# EAGLE design Controladora 60 amp directa (EAGLE 9.5.1)
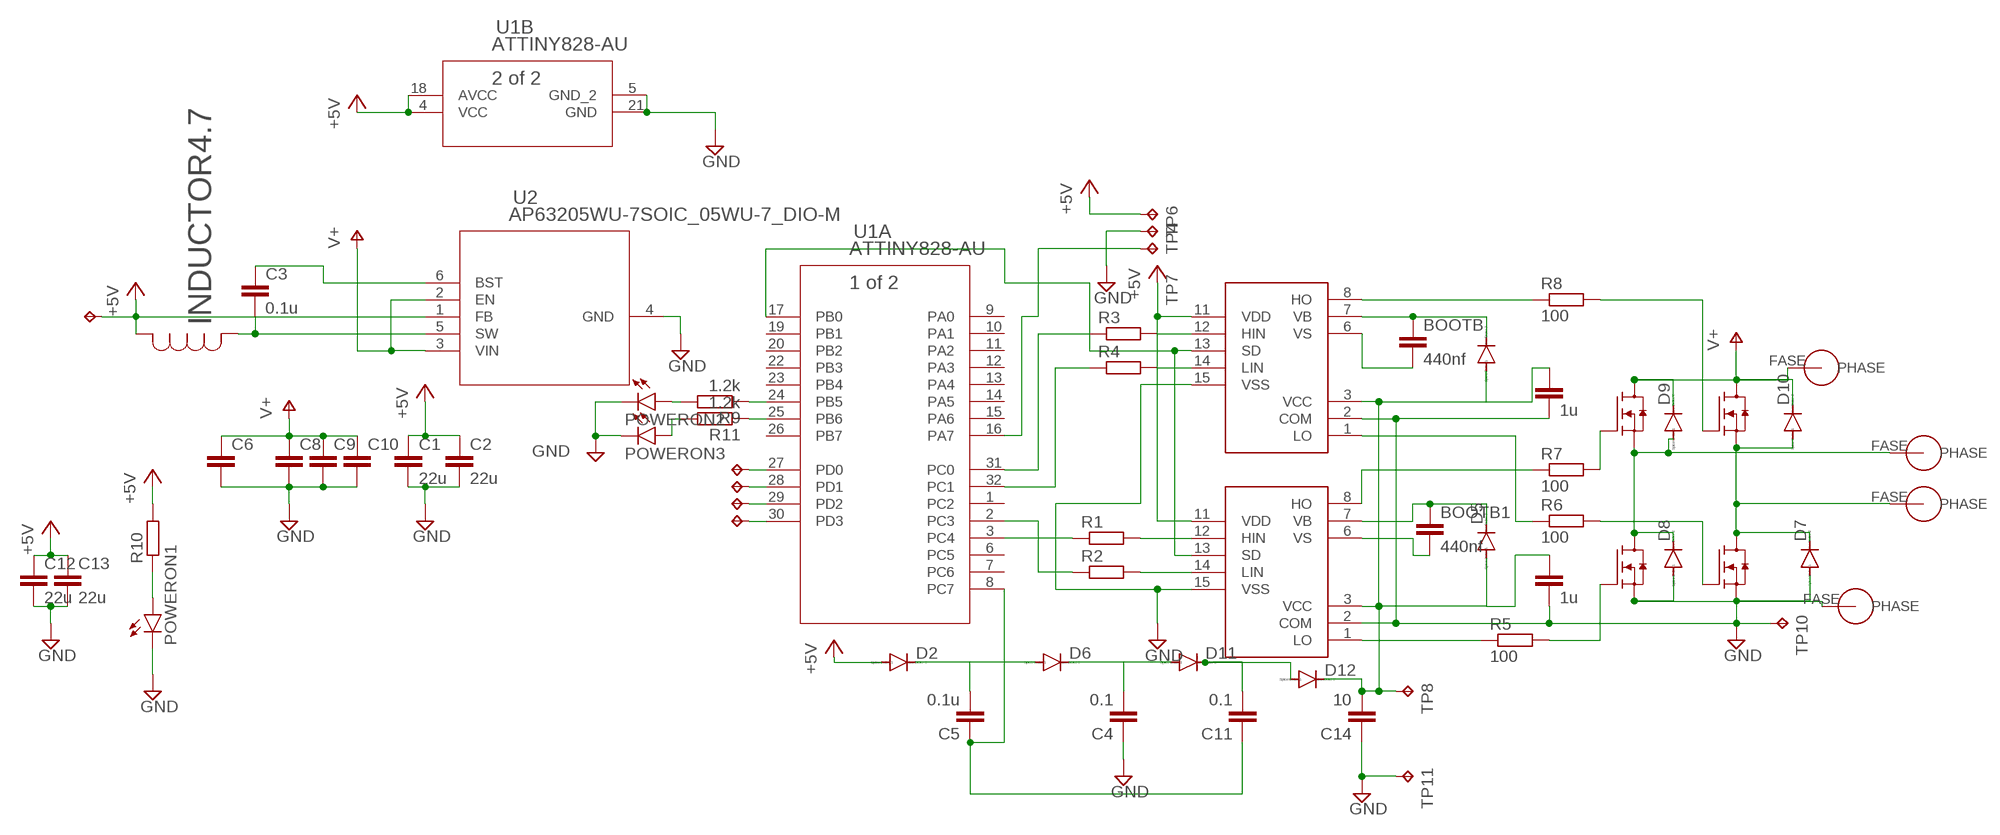
[diagram p0: schematic, sheet 1]

## Parts
BOOTB  440nf  C-EUC0805  [C0805]
BOOTB1  440nf  C-EUC0805  [C0805]
BYPASSBOOT  1u  C-EUC0805  [C0805]
BYPASSBOOT2  1u  C-EUC0805  [C0805]
C1  22u  C-EUC0805  [C0805]
C2  22u  C-EUC0805  [C0805]
C3  0.1u  C-EUC0402  [C0402]
C4  0.1  C-EUC0805  [C0805]
C5  0.1u  C-EUC0805  [C0805]
C6  C-EUC0805  [C0805]
C8  C-EUC0805  [C0805]
C9  C-EU050-035X075  [C050-035X075]
C10  C-EU050-035X075  [C050-035X075]
C11  0.1  C-EUC0805  [C0805]
C12  22u  C-EUC0402  [C0402]
C13  22u  C-EUC0402  [C0402]
C14  10  C-EUC0805  [C0805]
D1  IRS2110SPBF  [SOIC127P1030X265-16N]
D2  DIODE-MINIMELF  [MINIMELF]
D3  IRS2110SPBF  [SOIC127P1030X265-16N]
D4  DIODE-MINIMELF  [MINIMELF]
D5  DIODE-MINIMELF  [MINIMELF]
D6  DIODE-MINIMELF  [MINIMELF]
D7  DIODE-MINIMELF  [MINIMELF]
D8  DIODE-MINIMELF  [MINIMELF]
D9  DIODE-MINIMELF  [MINIMELF]
D10  DIODE-MINIMELF  [MINIMELF]
D11  DIODE-MINIMELF  [MINIMELF]
D12  DIODE-MINIMELF  [MINIMELF]
FASEA  PHASE  [POWEROUT]
FASEA1  PHASE  [POWEROUT]
FASEA2  PHASE  [POWEROUT]
FASEA3  PHASE  [POWEROUT]
LA  IPB180N06S4-H1  [PG-TO263-7-3]
LA1  IPB180N06S4-H1  [PG-TO263-7-3]
LA2  IPB180N06S4-H1  [PG-TO263-7-3]
LA3  IPB180N06S4-H1  [PG-TO263-7-3]
POWERON1  LEDCHIPLED_0603  [CHIPLED_0603]
POWERON2  LEDCHIPLED_0603  [CHIPLED_0603]
POWERON3  LEDCHIPLED_0603  [CHIPLED_0603]
R1  R-EU_M0805  [M0805]
R2  R-EU_M0805  [M0805]
R3  R-EU_M0805  [M0805]
R4  R-EU_M0805  [M0805]
R5  100  R-EU_M0805  [M0805]
R6  100  R-EU_M0805  [M0805]
R7  100  R-EU_M0805  [M0805]
R8  100  R-EU_M0805  [M0805]
R9  1.2k  R-EU_M0805  [M0805]
R10  R-EU_M0805  [M0805]
R11  1.2k  R-EU_M0805  [M0805]
TP1  TPTP16SQ  [TP16SQ]
TP2  TPTP16SQ  [TP16SQ]
TP3  TPTP16SQ  [TP16SQ]
TP4  TPTP16SQ  [TP16SQ]
TP5  TPTP16SQ  [TP16SQ]
TP6  TPTP16SQ  [TP16SQ]
TP7  TPTP16SQ  [TP16SQ]
TP8  TPB1,27  [B1,27]
TP9  TPB1,27  [B1,27]
TP10  TPB1,27  [B1,27]
TP11  TPB1,27  [B1,27]
U1  ATTINY828-AU  [32A_ATM]
U2  AP63205WU-7SOIC_05WU-7_DIO-M  [SOIC_05WU-7_DIO-M]
U$1  INDUCTOR4.7  [IND_NRS5030T100MMGJ_TAY]

## Nets
+5V: C1.1 C2.1 C12.1 C13.1 D1.11(VDD) D2.A D3.11(VDD) R10.2 TP6.TP TP9.TP U1.4(B:VCC) U1.18(B:AVCC) U2.1(FB) U$1.1
GND: BYPASSBOOT2.2 BYPASSBOOT.2 C1.2 C2.2 C4.1 C6.2 C8.2 C9.2 C10.2 C12.2 C13.2 C14.1 D1.2(COM) D1.15(VSS) D3.2(COM) D3.15(VSS) D7.A D8.A FASEA3.FASE(PHASE) LA1.2(S) LA1.3(S) LA1.5(S) LA1.6(S) LA1.7(S) LA3.2(S) LA3.3(S) LA3.5(S) LA3.6(S) LA3.7(S) POWERON1.C POWERON2.C POWERON3.C TP4.TP TP10.TP TP11.TP U1.5(B:GND_2) U1.21(B:GND) U2.4(GND)
N$1: TP3.TP U1.30(A:PD3)
N$2: TP2.TP U1.29(A:PD2)
N$3: TP1.TP U1.28(A:PD1)
N$4: TP5.TP U1.27(A:PD0)
N$5: R1.1 U1.3(A:PC4)
N$6: R2.1 U1.2(A:PC3)
N$7: BYPASSBOOT2.1 BYPASSBOOT.1 C14.2 D1.3(VCC) D3.3(VCC) D4.A D5.A D12.C TP8.TP
N$8: C5.2 D2.C D6.A
N$9: D1.12(HIN) R1.2
N$10: D1.14(LIN) R2.2
N$11: R3.1 U1.31(A:PC0)
N$12: D3.12(HIN) R3.2
N$13: R4.1 U1.32(A:PC1)
N$14: D3.14(LIN) R4.2
N$15: C3.2 U2.5(SW) U$1.2
N$16: TP7.TP U1.16(A:PA7)
N$17: D1.13(SD) D3.13(SD) U1.17(A:PB0)
N$18: D8.C D9.A FASEA.FASE(PHASE) LA1.8(D) LA.2(S) LA.3(S) LA.5(S) LA.6(S) LA.7(S)
N$19: D7.C D10.A FASEA1.FASE(PHASE) LA2.2(S) LA2.3(S) LA2.5(S) LA2.6(S) LA2.7(S) LA3.8(D)
N$20: C5.1 C11.1 U1.8(A:PC7)
N$21: D1.1(LO) R5.1
N$22: C3.1 U2.6(BST)
N$23: LA3.1(G) R6.2
N$24: D3.1(LO) R6.1
N$25: LA1.1(G) R5.2
N$26: D1.8(HO) R7.1
N$27: LA2.1(G) R8.2
N$28: D3.8(HO) R8.1
N$29: LA.1(G) R7.2
N$30: BOOTB1.1 D1.7(VB) D5.C
N$31: BOOTB1.2 D1.6(VS)
N$32: BOOTB.1 D3.7(VB) D4.C
N$33: BOOTB.2 D3.6(VS)
N$34: R9.1 U1.24(A:PB5)
N$35: POWERON1.A R10.1
N$36: POWERON2.A R9.2
N$37: R11.1 U1.25(A:PB6)
N$38: POWERON3.A R11.2
N$39: C4.2 D6.C D11.A
N$40: C11.2 D11.C D12.A
V+: C6.1 C8.1 C9.1 C10.1 D9.C D10.C FASEA2.FASE(PHASE) LA2.8(D) LA.8(D) U2.2(EN) U2.3(VIN)
Unconnected: U1.1(A:PC2) U1.6(A:PC5) U1.7(A:PC6) U1.9(A:PA0) U1.10(A:PA1) U1.11(A:PA2) U1.12(A:PA3) U1.13(A:PA4) U1.14(A:PA5) U1.15(A:PA6) U1.19(A:PB1) U1.20(A:PB2) U1.22(A:PB3) U1.23(A:PB4) U1.26(A:PB7)

## Library data of the parts
BOOTB BOOTB1 BYPASSBOOT BYPASSBOOT2 = resistor:C-EU: CAPACITOR, European symbol
C1-C6 C8-C14 = rcl:C-EU: CAPACITOR, European symbol; SPICEPREFIX: C
D1 D3 = SOIC127P1030X265-16N:IRS2110SPBF: IRS2110SPBF MOSFET DRIVER 500-600 V IOUT 2 AMP 130 NS ON 120 NS OFF
D2 D4-D12 = diode:DIODE-: DIODE
FASEA FASEA1-FASEA3 = PHASE:PHASE
LA LA1-LA3 = infineon:IPB180N06S4-H1: OptiMOS®-T2 Power-Transistor Source: 1859075.pdf (Farnell)
POWERON1-POWERON3 = led:LED: LED OSRAM: - CHIPLED LG R971, LG N971, LY N971, LG Q971, LY Q971, LO R971, LY R971 LH N974, LH R974 LS Q976, LO Q976, LY Q976 LO Q996 - Hyper CHIPLED LW Q18S LB Q993, LB Q99A, LB R99A - SideLED LS A670, LO A670, LY A670, LG A670, LP A670 LB A673, LV A673, LT A673, LW A673 LH A674 LY A675 LS A676, LA A676, LO A676, LY A676, LW A676 LS A679, LY A679, LG A679 - Hyper Micro SIDELED® LS Y876, LA Y876, LO Y876, LY Y876 LT Y87S - SmartLED LW L88C, LW L88S LB L89C, LB L89S, LG L890 LS L89K, LO L89K, LY L89K LS L896, LA L896, LO L896, LY L896 - TOPLED LS T670, LO T670, LY T670, LG T670, LP T670 LSG T670, LSP T670, LSY T670, LOP T670, LYG T670 LG T671, LOG T671, LSG T671 LB T673, LV T673, LT T673, LW T673 LH T674 LS T676, LA T676, LO T676, LY T676, LB T676, LH T676, LSB T676, LW T676 LB T67C, LV T67C, LT T67C, LS T67K, LO T67K, LY T67K, LW E67C LS E67B, LA E67B, LO E67B, LY E67B, LB E67C, LV E67C, LT E67C LW T67C LS T679, LY T679, LG T679 LS T770, LO T770, LY T770, LG T770, LP T770 LB T773, LV T773, LT T773, LW T773 LH T774 LS E675, LA E675, LY E675, LS T675 LS T776, LA T776, LO T776, LY T776, LB T776 LHGB T686 LT T68C, LB T68C - Hyper Mini TOPLED® LB M676 - Mini TOPLED Santana® LG M470 LS M47K, LO M47K, LY M47K Source: http://www.osram.convergy.de LUXEON: - LUMILED® LXK2-PW12-R00, LXK2-PW12-S00, LXK2-PW14-U00, LXK2-PW14-V00 LXK2-PM12-R00, LXK2-PM12-S00, LXK2-PM14-U00 LXK2-PE12-Q00, LXK2-PE12-R00, LXK2-PE12-S00, LXK2-PE14-T00, LXK2-PE14-U00 LXK2-PB12-K00, LXK2-PB12-L00, LXK2-PB12-M00, LXK2-PB14-N00, LXK2-PB14-P00, LXK2-PB14-Q00 LXK2-PR12-L00, LXK2-PR12-M00, LXK2-PR14-Q00, LXK2-PR14-R00 LXK2-PD12-Q00, LXK2-PD12-R00, LXK2-PD12-S00 LXK2-PH12-R00, LXK2-PH12-S00 LXK2-PL12-P00, LXK2-PL12-Q00, LXK2-PL12-R00 Source: www.luxeon.com KINGBRIGHT: KA-3528ASYC Source: www.kingbright.com
R1-R11 = rcl:R-EU_: RESISTOR, European symbol; SPICEPREFIX: R
TP1-TP11 = testpad:TP: Test pad
U1 = nuevoattiny828:ATTINY828-AU; BUILT_BY: EMA_UL_Team; MANUFACTURER_PART_NUMBER: ATTINY828-AU; SOURCELIBRARY: Atmel_2015-02-13; VENDOR: Atmel
U2 = AP63205WU-7:AP63205WU-7; BUILT_BY: EMA_Matt; COPYRIGHT: Copyright (C) 2018 Accelerated Designs. All rights reserved; MANUFACTURER_PART_NUMBER: AP63205WU-7; SOURCELIBRARY: Diodes_Inc_2019-12-05; VENDOR: Diodes Inc
U$1 = Inductor4.7:INDUCTOR4.7

## Board
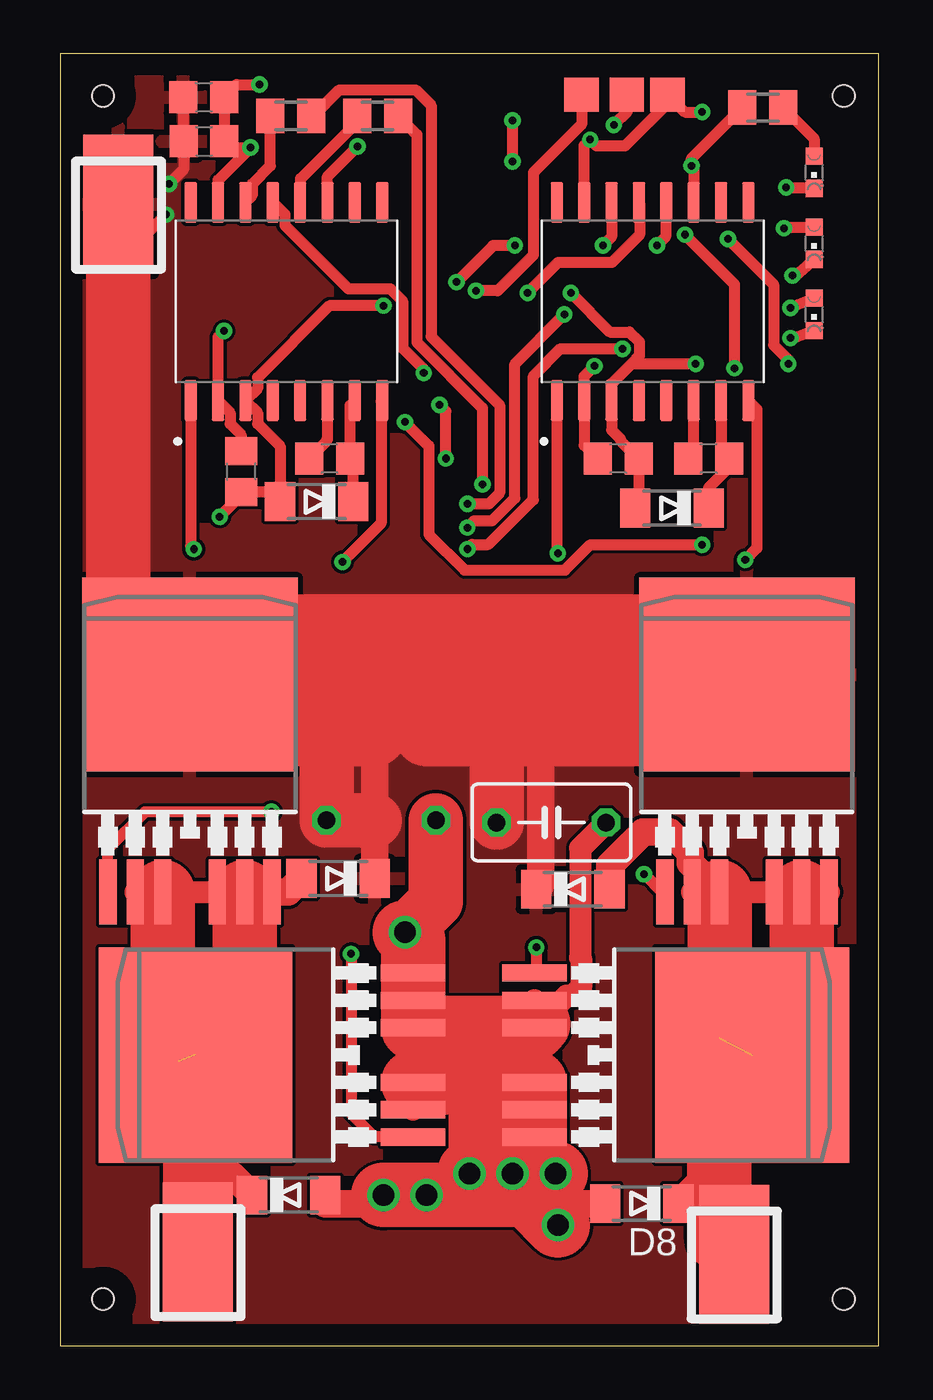
[diagram p1: board, top side]
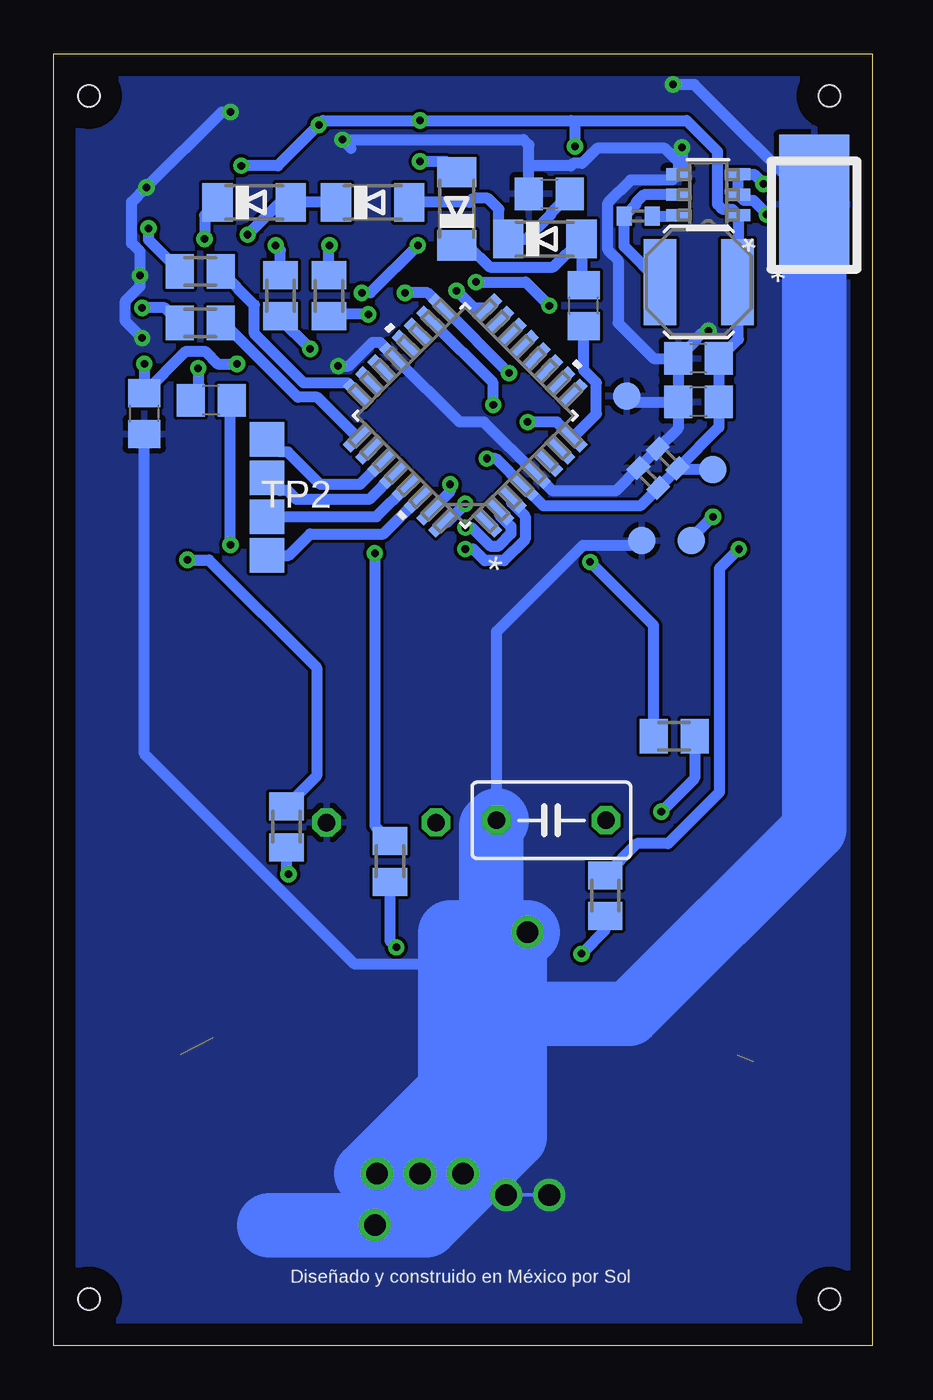
[diagram p2: board, bottom side, seen from below]

Size 38 x 60 mm. Coordinates in mm from the lower left corner, seen from the top.
Outline: 0,0 38,0 38,60 0,60 0,0
Copper layers (1*16): Top 0.035mm / dielectric 1.5mm / Bottom 0.035mm
Design rules "default": minimum track width 6mil, minimum drill 0.35mm, track to track 6mil, track to pad 6mil, pad to pad 6mil, via to via 6mil, smd to smd 6mil, copper to edge 40mil, drill to drill 6mil, minimum pad ring 10mil, minimum via ring 8mil, stop-mask expansion 4mil, vias tented up to drill 0mil, thermal gap 10mil
Holes 1 mm at 1.98,2.16 36.37,2.16 36.37,58.04 1.98,58.04

### Footprints (pad centres in the part's own frame; a part is rotated, then mirrored left to right if it is on the bottom)
C0805 = smd 1.3 x 1.5: 1 -0.95,0; 2 0.95,0
C0402 = smd 0.7 x 0.9: 1 -0.65,0; 2 0.65,0
C050-035X075 = drill 0.813 octagon: 1 -2.54,0; 2 2.54,0
SOIC127P1030X265-16N = smd 1.9 x 0.6: 1 -4.605,4.445; 2 -4.605,3.175; 3 -4.605,1.905; 4 -4.605,0.635; 5 -4.605,-0.635; 6 -4.605,-1.905; 7 -4.605,-3.175; 8 -4.605,-4.445; 9 4.605,-4.445; 10 4.605,-3.175; 11 4.605,-1.905; 12 4.605,-0.635; 13 4.605,0.635; 14 4.605,1.905; 15 4.605,3.175; 16 4.605,4.445
MINIMELF = smd 1.4 x 1.8: A 1.7,0; C -1.7,0
POWEROUT = smd 3.251 x 6.452: FASE 0,0
PG-TO263-7-3 = smd 0.8 x 3: 1 -3.81,-9.207; 2 -2.54,-9.207; 3 -1.27,-9.207; 5 1.27,-9.207; 6 2.54,-9.207; 7 3.81,-9.207 | smd 10 x 9: 8 0,0.895
CHIPLED_0603 = smd 0.8 x 0.8: A 0,-0.75; C 0,0.75
M0805 = smd 1.3 x 1.6: 1 -0.95,0; 2 0.95,0
TP16SQ = smd 1.6 x 1.6: TP 0,0
B1,27 = smd 1.27 x 1.27: TP 0,0
32A_ATM = smd 1.45 x 0.51: 1 -4.25,2.8; 2 -4.25,2; 3 -4.25,1.2; 4 -4.25,0.4; 5 -4.25,-0.4; 6 -4.25,-1.2; 7 -4.25,-2; 8 -4.25,-2.8; 17 4.25,-2.8; 18 4.25,-2; 19 4.25,-1.2; 20 4.25,-0.4; 21 4.25,0.4; 22 4.25,1.2; 23 4.25,2; 24 4.25,2.8 | smd 0.51 x 1.45: 9 -2.8,-4.25; 10 -2,-4.25; 11 -1.2,-4.25; 12 -0.4,-4.25; 13 0.4,-4.25; 14 1.2,-4.25; 15 2,-4.25; 16 2.8,-4.25; 25 2.8,4.25; 26 2,4.25; 27 1.2,4.25; 28 0.4,4.25; 29 -0.4,4.25; 30 -1.2,4.25; 31 -2,4.25; 32 -2.8,4.25
SOIC_05WU-7_DIO-M = smd 1.096 x 0.557: 1 -1.399,0.95; 2 -1.399,0; 3 -1.399,-0.95; 4 1.399,-0.95; 5 1.399,0; 6 1.399,0.95
IND_NRS5030T100MMGJ_TAY = smd 1.499 x 3.988: 1 -1.8,0; 2 1.8,0

### Placement (x,y rotation side)
BOOTB  12.5,41.2 180 top
BOOTB1  30.1,41.2 180 top
BYPASSBOOT  8.4,40.6 90 top
BYPASSBOOT2  25.9,41.2 180 top
C1  8.07,43.83 180 bottom
C2  8.07,45.85 180 bottom
C3  10.87,52.46 180 bottom
C4  15,53.5 0 bottom
C5  13.4,48.3 90 bottom
C6  6.65,57.99 0 top
C8  6.67,55.94 0 top
C9  14.9,24.4 180 bottom
C10  22.8,24.3 0 top
C11  30.7,43.9 180 bottom
C12  9.5,41.2 135 bottom
C13  10.4,40.3 135 bottom
C14  33.8,43.3 90 bottom
D1  27.5,48.5 90 top
D2  19.3,52.8 90 bottom
D3  10.5,48.5 90 top
D4  11.9,39.2 180 top
D5  28.4,38.9 180 top
D6  15.2,51.4 0 bottom
D7  10.6,7 0 top
D8  27,6.6 180 top
D9  23.8,21.2 0 top
D10  12.9,21.7 180 top
D11  23.2,53.1 0 bottom
D12  28.7,53.1 0 bottom
FASEA  31.29,4.25 0 top
FASEA1  6.39,4.35 0 top
FASEA2  2.7,53.01 0 top
FASEA3  2.7,53.01 0 bottom
LA  31.88,30.28 0 top
LA1  31.23,13.5 270 top
LA2  6.02,30.28 0 top
LA3  7.17,13.5 90 top
POWERON1  35,54.5 180 top
POWERON2  35,51.2 180 top
POWERON3  35,47.9 180 top
R1  27.48,48.77 90 bottom
R2  25.23,48.76 90 bottom
R3  14.73,57.12 180 top
R4  10.7,57.11 180 top
R5  22.4,22.5 270 bottom
R6  12.4,20.9 270 bottom
R7  27.2,24.1 270 bottom
R8  9.2,28.3 0 bottom
R9  31.2,49.9 180 bottom
R10  32.62,57.5 180 top
R11  31.2,47.5 180 bottom
TP1  28.1,40.3 0 bottom
TP2  28.1,38.5 0 bottom
TP3  28.1,36.7 0 bottom
TP4  28.2,58.1 0 top
TP5  28.1,42.1 0 bottom
TP6  26.3,58.1 0 top
TP7  24.2,58.1 0 top
TP8  8.4,37.4 0 bottom
TP9  7.4,40.7 0 bottom
TP10  10.7,37.4 0 bottom
TP11  11.4,44.1 0 bottom
U1  18.9,43.2 135 bottom
U2  7.62,53.45 180 bottom
U$1  8.06,49.4 180 bottom

### Tracks (layer width: path | path; a pad name or v marks a point on that pad's centre or on a via)
+5V  (via drill 0.35)
  Top 0.508: v17.9,41.2 17.9,43.4 v17.6,43.7 | TP6.TP 26.3,57.3 v25.7,56.7 | D1.11 29.41,54.7 v29.3,54.8 29.3,55.13 R10.2 | D3.11 12.4,54.3 v13.8,55.7 | v21,55 v21,56.9 21,57
  Bottom 0.508: 6.22,49.44 U2.1 6.49,52.77 6.94,52.77 7.18,53.01 7.18,55.46 8.62,56.9 14,56.9 | 6.22,49.44 U$1.1 | 6.22,49.44 6.22,46.75 C2.1 C1.1 | C1.1 7.12,43.64 | v17.9,41.2 17.47,41.2 U1.4 15.27,39 10.78,39 C13.1 C12.1 | v17.6,43.7 17.6,44.73 U1.18 | 14,56.9 v21,56.9 25.5,56.9 v25.7,56.7 27.6,54.8 v29.3,54.8 | v13.8,55.7 13.8,56.7 14,56.9 | C1.1 7.12,42.66 C12.1 | D2.A 19.8,55 v21,55 | TP9.TP 9,40.7 C12.1
GND  (via drill 0.35, 1)
  Top 0.152: v21,8 v23,8
  Top 0.508: v7.6,47.13 7.33,46.86 D3.2 7.89,43.33 7.89,42.82 8.4,42.31 BYPASSBOOT.2 | D3.15 7.33,54.14 v8.83,55.65 7.91,55.65 C8.2 7.6,55.96 C6.2 8.19,58.57 v9.25,58.57 | D1.15 24.32,55.74 v24.6,56.02 24.9,55.72 26.21,55.72 28.2,57.7 TP4.TP 29,57.3 v29.8,57.3 | v24.8,45.5 24.32,45.02 D1.2 24.32,41.83 BYPASSBOOT2.2 | POWERON1.C 33.75,53.75 v33.7,53.8 | POWERON2.C 34.15,49.7 v34,49.7 | POWERON3.C 33.95,46.75 v33.9,46.8
  Top 1.016: LA3.2 LA3.3 LA3.5 LA3.6 LA3.7 | LA1.2 LA1.3 LA1.5 LA1.6 LA1.7 | 22.2,14.95 23.5,16.25 23.8,16.25 24.18,16.64 24.18,17.98 24.14,18.03 24.14,23.1 C10.2
  Top 1.27: D7.A 12.3,6.6 22.1,6.6 v23.1,5.6 23.3,5.6 24.3,6.6 D8.A
  Top 2.54: C9.2 17.44,20.64 v16,19.2
  Top 3: LA3.3 LA1.5 22.02,6.68 v23.1,5.6 | v16,19.2 16.38,18.82 LA3.5 LA1.3 22.2,14.95 | v23,8 22,7 v15,7 | v19,8 19,8.08 19.53,8.61 19.53,11.53 20,12
  Bottom 0.152: 16.6,9.7 16.6,7.4 v17,7 | v17,7 18,7 v19,8 v21,8 | v17,7 v15,7
  Bottom 0.508: U2.4 9.28,54.13 11.22,54.13 12.28,53.08 12.28,50.88 11.8,50.41 11.8,47.5 10.15,45.85 C2.2 | 24.2,55.62 v24.6,56.02 16.2,56.02 15.95,55.77 15.95,54.8 | U2.4 9.02,55 9.63,55.62 12.78,55.62 13.47,54.91 13.88,54.91 14,54.8 15.95,54.8 | C4.1 15.95,54.8 | C2.2 C1.2 | v7.6,47.13 7.72,47.01 7.94,47.01 8.18,46.77 8.18,46.69 C2.2 | v8.83,55.65 8.83,54.59 U2.4 | v24.8,45.5 24.3,45.5 23.2,46.6 22.87,46.6 U1.21 19.17,42.9 18.03,42.9 U1.5 14.83,39.7 11.92,39.7 C13.2 C12.2 9.02,42.6 C1.2 | FASEA3.FASE 8.27,58.57 v9.25,58.57 | v29.8,57.3 30.2,57.3 v33.7,53.8 34.38,53.12 34.38,51.2 34,50.82 v34,49.7 34,49.21 34.69,48.52 34.69,47.59 v33.9,46.8 | 19.5,16.5 20.71,17.71 24.02,17.71 33.8,27.49 C14.1 | TP10.TP 10.91,37.19 13.43,37.19 17.44,33.17 C9.2 | TP11.TP 11.13,43.83 C1.2
  Bottom 3: 28,5.6 v23.1,5.6 | 19.2,19.2 19.5,18.9 19.5,16.5 19.5,9.2 v23.1,5.6 | 19.2,19.2 v16,19.2 16.6,18.6 16.6,9.7 20.7,5.6 v23.1,5.6 | 19.2,19.2 19.6,19.2 19.6,11.9 23.5,8 | FASEA3.FASE 2.7,24 11.3,15.4 17.7,15.4 17.7,24.14 C9.2
  pour Bottom: 0,0 0,60 38,60 38,0
N$1
  Bottom 0.508: U1.30 22.7,37.7 26.1,37.7 27.1,36.7 TP3.TP
N$2
  Bottom 0.508: U1.29 23.03,38.51 TP2.TP
N$3
  Bottom 0.508: U1.28 23.37,39.3 26.73,39.3 27.13,39.71 27.51,39.71 TP1.TP
N$4
  Bottom 0.508: TP5.TP 27.51,41.51 27.13,41.51 25.63,40 23.8,40 U1.27
N$5  (via drill 0.35)
  Top 0.508: v18.9,37 19.11,37.21 19.88,37.21 21.96,39.29 21.96,45.04 23.22,46.3 v26.1,46.3
  Bottom 0.508: U1.3 16.74,39.15 16.11,38.52 16.11,37.44 17.1,36.45 17.98,36.45 18.53,37 v18.9,37 | v26.1,46.3 27.48,47.68 R1.1
N$6  (via drill 0.35)
  Top 0.508: v18.89,37.99 19.21,38.31 20.05,38.31 21.1,39.37 21.1,45.6 v23.4,47.9
  Bottom 0.508: v18.89,37.99 18.59,37.99 17.71,37.12 17.37,37.12 16.77,37.71 16.77,38.05 17.31,38.59 U1.2 | v23.4,47.9 25.14,47.9 R2.1
N$7  (via drill 0.35)
  Top 0.508: v23.7,48.9 25.52,47.09 26.43,47.09 26.89,46.62 26.89,45.98 26.51,45.6 | 26.51,45.6 25.59,44.69 D1.3 25.59,42.53 26.01,42.12 26.01,42.04 BYPASSBOOT2.1 26.85,39.05 D5.A | v21.1,51.1 20.1,51.1 v18.4,49.4 | v15,48.3 12.49,48.3 9.16,44.97 9.16,44.46 D3.3 9.16,43.33 9.16,42.82 10.2,41.78 D4.A 9.75,39.65 BYPASSBOOT.1 8.4,39.5 v7.4,38.5 | v31,51.4 33.12,49.28 33.12,46.48 33.8,45.79 v33.8,45.6 | v29.5,45.6 26.51,45.6
  Bottom 0.508: v21.1,51.1 23.3,48.9 v23.7,48.9 | v18.4,49.4 16.1,49.4 v15,48.3 | D12.C 31,52.5 v31,51.4 | v33.8,45.6 C14.2 31.86,46.19 30.98,46.19 30.39,45.6 v29.5,45.6 | v7.4,38.5 8.4,37.5 TP8.TP
N$8
  Bottom 0.508: D2.C 18.77,51.1 17.77,50.09 14.81,50.09 D6.A 13.5,49.35 C5.2
N$9  (via drill 0.35)
  Top 0.508: v27.7,51.1 28.1,51.5 28.1,53.11 D1.12
  Bottom 0.508: R1.2 27.48,50.88 v27.7,51.1
N$10  (via drill 0.35)
  Top 0.508: v25.2,51.1 25.6,51.5 D1.14
  Bottom 0.508: R2.2 25.23,51.07 v25.2,51.1
N$11  (via drill 0.35)
  Top 0.508: R3.1 16.55,56.24 16.55,53.9 16.55,46.6 19.6,43.56 v19.6,40
  Bottom 0.508: U1.31 19.6,39.67 v19.6,40
N$12
  Top 0.508: D3.12 11.16,54.21 13.78,56.83 R3.2
N$13  (via drill 0.35)
  Top 0.508: R4.1 11.75,57.11 12.96,58.33 16.5,58.33 17.21,57.61 17.21,46.88 20.4,43.69 20.4,39.6 19.9,39.1 v18.9,39.1
  Bottom 0.508: U1.32 19.79,38.22 v18.9,39.1
N$14
  Top 0.508: D3.14 8.9,53.41 8.91,53.95 9.75,54.79 R4.2
N$15
  Bottom 0.508: U2.5 10.61,53.45 10.98,53.08 10.98,53 C3.2 11.52,51.06 U$1.2
N$16  (via drill 0.35)
  Top 0.508: TP7.TP 24.2,56.73 21.96,54.48 21.96,50.66 20.3,49 v19.3,49
  Bottom 0.508: U1.16 18.48,48.19 v19.3,49
N$17  (via drill 0.35)
  Top 0.508: v21.7,48.9 23.11,50.31 25.62,50.31 26.9,51.59 26.9,53.07 D1.13 | D3.13 10.43,52.54 10.43,52.03 13.38,49.09 15.32,49.09 15.89,48.52 15.89,46.33 16.87,45.35 v16.87,45.17
  Bottom 0.508: v21.7,48.9 20.64,48.9 U1.17 19.89,48.19 v16.87,45.17
N$18  (1 unrouted)
  Top 1.016: LA.2 LA.3 LA.5 LA.6 LA.7
  Top 1.27: D8.C 30.6,8.5 | D9.A 25.5,22.3 27.06,23.86 28.3,23.86 29.26,22.9 29.26,22.43 LA.3
  Top 3: 31.29,4.99 FASEA.FASE 30.6,4.94 30.6,8.5 30.6,8.96 30.6,14.3 | LA.6 34.42,14.62 32.5,12.7 | LA.3 30.61,15.02 LA1.8
N$19  (1 unrouted)
  Top 1.016: LA2.2 LA2.3 LA2.5 LA2.6 LA2.7
  Top 1.27: D7.C 8.02,7.88 6.28,7.88 | D10.A 10.57,21.07 LA2.6
  Top 3: FASEA1.FASE 6.28,4.24 6.28,7.88 LA3.8 | LA2.6 8.56,16.26 5.5,13.2 | LA2.3 4.75,14.55 6.9,12.4
N$20  (via drill 0.35)
  Top 0.508: v29.8,37.2 24.61,37.2 23.43,36.02 18.77,36.02 17.11,37.67 17.11,41.78 v16,42.9
  Bottom 0.508: C5.1 13.4,45.31 12.82,44.73 12.82,43.27 U1.8 14.64,42.9 v16,42.9 | v29.8,37.2 29.8,43.85 C11.1
N$21  (via drill 0.35)
  Top 0.508: D1.1 23.05,36.84 v23.1,36.8
  Bottom 0.508: v23.1,36.8 23.1,24.15 R5.1
N$22
  Bottom 0.508: C3.1 9.06,52.46 U2.6
N$23  (via drill 0.35)
  Top 0.508: v13.5,18.2 13.5,10.77 14.58,9.69 LA3.1
  Bottom 0.508: R6.2 12.4,19.3 v13.5,18.2
N$24  (via drill 0.35)
  Top 0.508: D3.1 6.05,37.15 v6.2,37
  Bottom 0.508: v6.2,37 7.1,36.1 7.1,25.7 9.48,23.32 10.94,23.32 R6.1
N$25  (via drill 0.35)
  Top 0.508: v22.1,18.5 22.1,17.39 LA1.1
  Bottom 0.508: R5.2 22.4,18.8 v22.1,18.5
N$26  (via drill 0.35)
  Top 0.508: D1.8 32.34,43.49 32.34,37.05 v31.8,36.5
  Bottom 0.508: v31.8,36.5 30.8,36.5 25.8,31.5 25.8,26.45 R7.1
N$27  (via drill 0.35)
  Top 0.508: v9.8,24.8 3.94,24.8 2.21,23.07 LA2.1
  Bottom 0.508: v9.8,24.8 8.25,26.35 R8.2
N$28  (via drill 0.35)
  Top 0.508: D3.8 14.9,43.85 14.9,38.2 v13.1,36.4
  Bottom 0.508: R8.1 10.15,33.45 v13.1,36.4
N$29  (via drill 0.35)
  Top 0.508: v27.1,21.9 27.93,21.07 LA.1
  Bottom 0.508: R7.2 27.2,22 v27.1,21.9
N$30
  Top 0.508: D1.7 30.68,41.58 BOOTB1.1 31.05,40.8 30.1,39.85 D5.C
N$31
  Top 0.508: BOOTB1.2 29.41,41.45 D1.6
N$32
  Top 0.508: D3.7 13.45,43.67 BOOTB.1 13.6,41.05 D4.C
N$33
  Top 0.508: D3.6 12.4,42.13 12.39,42.12 12.39,42.04 BOOTB.2
N$34
  Bottom 0.508: U1.24 24.38,44.72 26.4,44.72 28.69,47 28.69,48.34 R9.1
N$35
  Top 0.508: R10.1 35,56.07 POWERON1.A
N$36  (via drill 0.35)
  Top 0.508: v33.6,51.9 33.65,51.95 POWERON2.A
  Bottom 0.508: R9.2 33.6,51.35 v33.6,51.9
N$37
  Bottom 0.508: U1.25 25.77,44.05 26.67,44.05 30.12,47.5 R11.1
N$38  (via drill 0.35)
  Top 0.508: v33.9,48.2 33.95,48.25 POWERON3.A
  Bottom 0.508: R11.2 32.85,48.2 v33.9,48.2
N$39
  Bottom 0.508: C4.2 14.89,52.66 14.89,52.58 16.07,51.4 D6.C 17.34,51.84 17.34,52.77 17.85,53.28 18.52,53.28 18.71,53.1 D11.A
N$40  (via drill 0.35)
  Top 0.508: v29,51.6 31.3,49.3 v31.3,45.4
  Bottom 0.508: D11.C D12.A 27.5,53.1 v29,51.6 | v31.3,45.4 31.3,44.25 C11.2
V+  (via drill 0.35)
  Top 0.508: v4.9,52.53 3.97,51.6 2.7,51.6 | v5.05,53.96 5.72,54.63 C8.1 5.7,55.96 C6.1
  Top 1.27: D9.C 22.3,21.4 22.3,28.3 22.4,28.4 | D10.C 14.6,24.4 14.6,28.4
  Top 2.54: 12.7,29.1 12.36,28.76 C9.1 14.6,24.4 | 20.2,28.4 20.26,28.34 C10.1
  Top 3: FASEA2.FASE 2.7,51.6 2.7,34.3 6.5,30.5 31.2,30.5 LA.8 | 31.9,33.4 8.24,33.4 LA2.8 8.79,28.4 14.6,28.4 | 32.3,30.5 30.2,28.4 22.4,28.4 20.2,28.4 17,28.4
  Bottom 0.508: v4.9,52.53 4.9,52.58 5.5,53.19 5.96,53.19 U2.2 U2.3 5.6,54.4 5.6,54.41 5.49,54.41 v5.05,53.96
  pour Top: 0,-0.05 0,60 38,60 38,-0.05

### Text on the board
bPlace: Diseñado y construido en México por Sol